# Altium schematic sheet TOC.SchDoc: Table of Contents
size A4; CompanyName: St. Cloud State University; Organization: Senior Design Project; Address1: Prosthetic Hand; Address2: Matthew Varas; Address3: Rachel Mertz; Address4: Donnell Jones; DocumentNumber: 1; Revision: 1.1; SheetNumber: 1; SheetTotal: 6
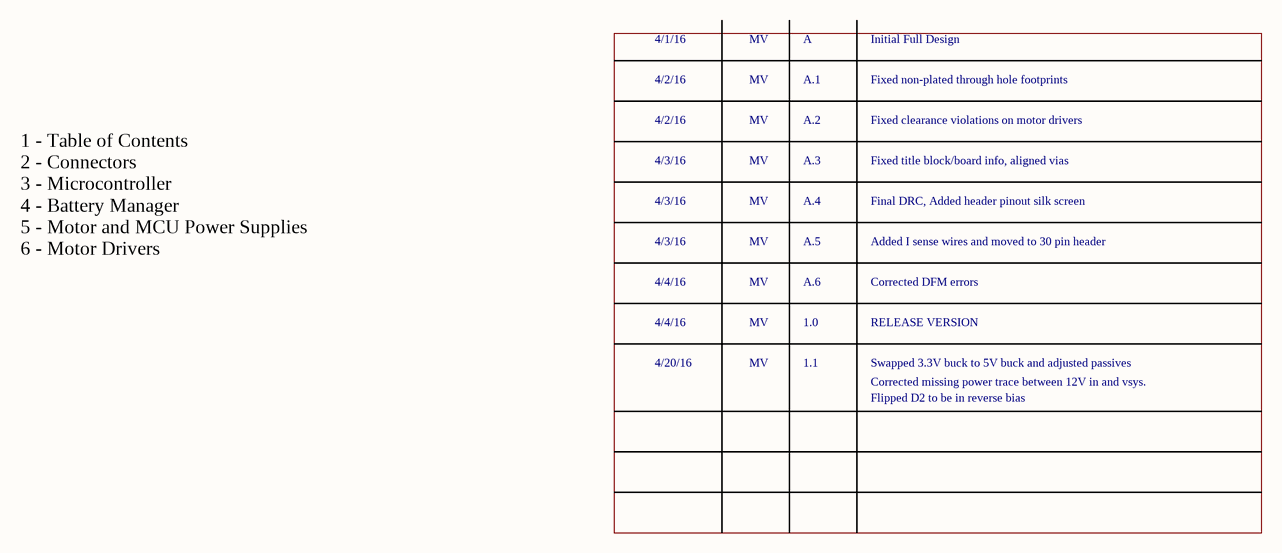
[diagram p0: TOC.SchDoc]

## Notes on the sheet
- 4/1/16
- 4/2/16
- MV
- A
- A.1
- Initial Full Design
- Fixed non-plated through hole footprints
- 4/3/16
- A.2
- A.3
- Fixed clearance violations on motor drivers
- Fixed title block/board info, aligned vias
- A.4
- Final DRC, Added header pinout silk screen
- 1 - Table of Contents
  2 - Connectors
  3 - Microcontroller
  4 - Battery Manager
  5 - Motor and MCU Power Supplies
  6 - Motor Drivers
- 4/4/16
- A.5
- A.6
- Added I sense wires and moved to 30 pin header
- Corrected DFM errors
- 4/20/16
- 1.0
- 1.1
- RELEASE VERSION
- Swapped 3.3V buck to 5V buck and adjusted passives
- Corrected missing power trace between 12V in and vsys.
- Flipped D2 to be in reverse bias
- Title
- Size:
- Date:
- A4
- Number:
- Time:
- Revision:
- Sheet
- of
- File: